# EAGLE schematic JKW_standalone (EAGLE 5.11)
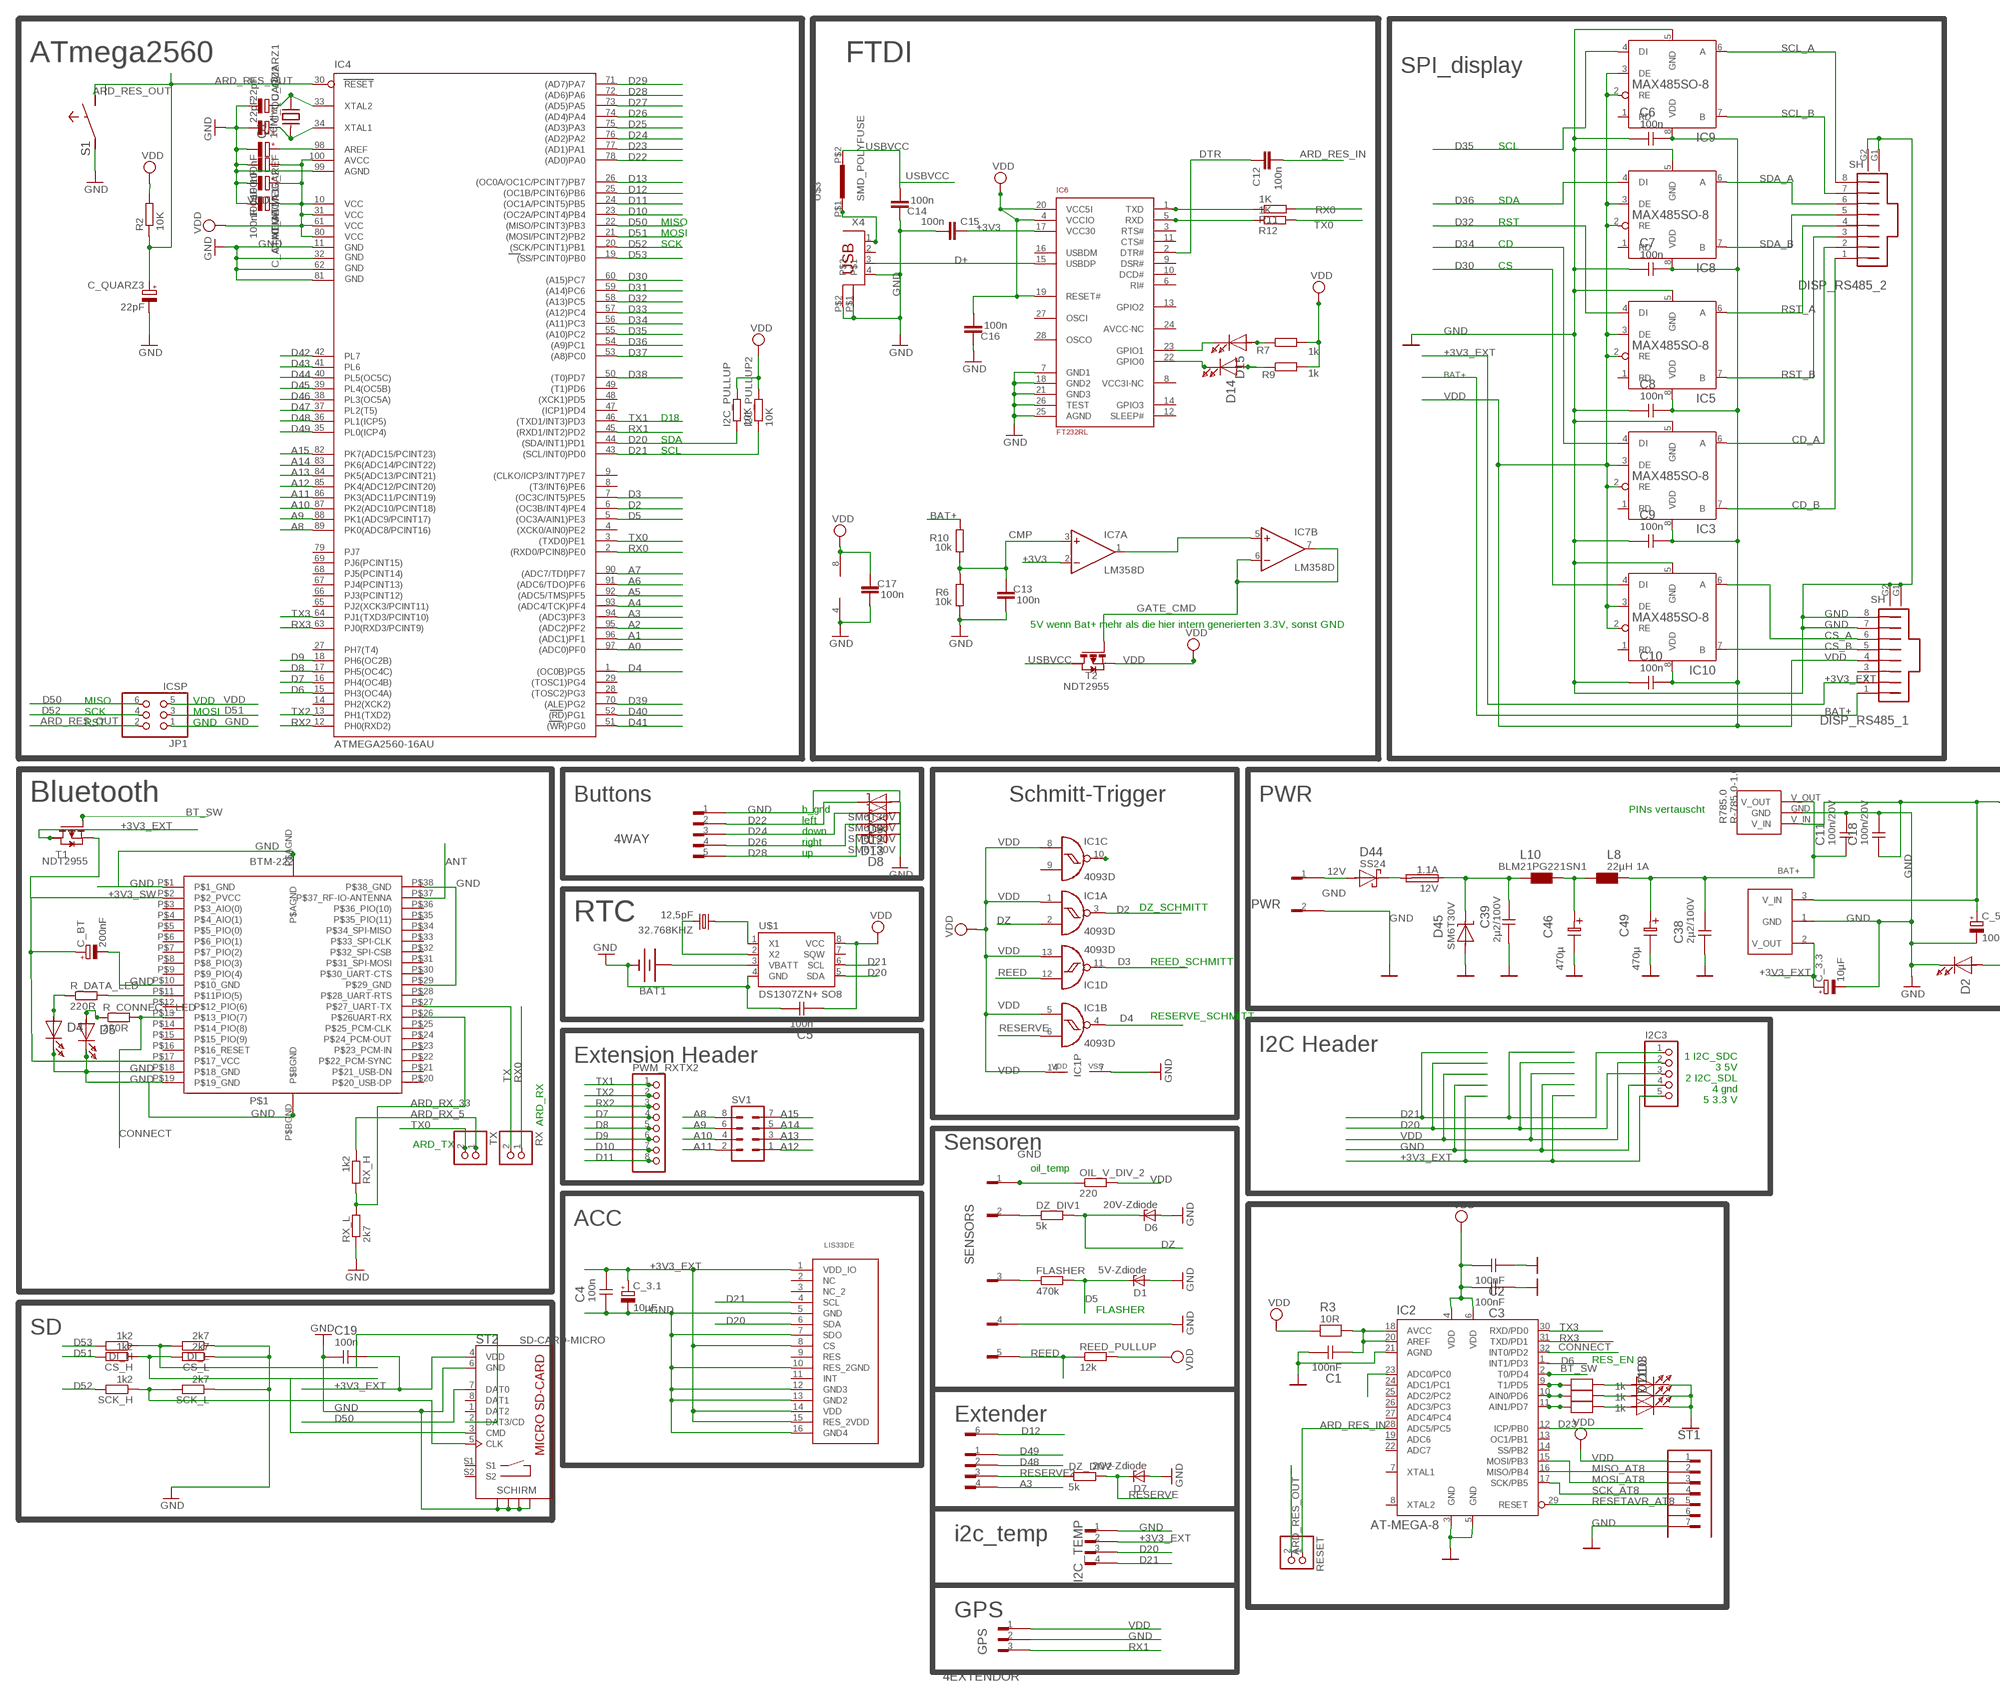
[diagram p0: schematic, sheet 1, part 1 of 2]
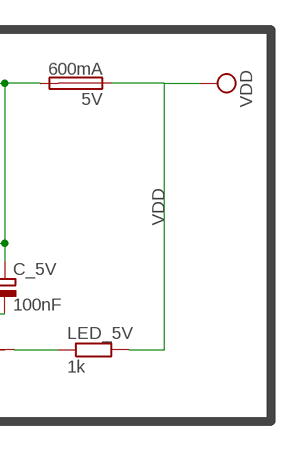
[diagram p1: schematic, sheet 1, part 2 of 2]

## Parts
4EXTENDOR  ST-04MCG35-04  [MCG35-04]
4WAY  ST-05MCG35-05  [MCG35-05]
5V  600mA  KOLJA_FUSE  [KOLJA_FUSE]
12V  1.1A  KOLJA_FUSE  [KOLJA_FUSE]
32.768KHZ  12,5pF  CRYSTALTC38H  [TC38H]
BAT1  BATTERY12PTH  [BATTCON_12MM_PTH]
C1  100nF  C0805  [0805]
C2  100nF  C0805  [0805]
C3  100nF  C0805  [0805]
C4  100n  C0805  [0805]
C5  100n  C0805  [0805]
C6  100n  C0805  [0805]
C7  100n  C0805  [0805]
C8  100n  C0805  [0805]
C9  100n  C0805  [0805]
C10  100n  C0805  [0805]
C11  100n/20V  C1210  [1210]
C12  100n  C-EUC0805  [C0805]
C13  100n  C-EUC0805  [C0805]
C14  100n  C-EUC0805  [C0805]
C15  100n  C-EUC0805  [C0805]
C16  100n  C-EUC0805  [C0805]
C17  100n  C-EUC0805  [C0805]
C18  100n/20V  C1210  [1210]
C19  100n  C0805  [0805]
C38  2µ2/100V  C1210  [1210]
C39  2µ2/100V  C1210  [1210]
C46  470µ  C-ELKO-5-8X13  [EL-5-8X13]
C49  470µ  C-ELKO-5-8X13  [EL-5-8X13]
C_3.1  10µF  CPOL-EUSMCP  [SMC_P]
C_3.3  10µF  CPOL-EUSMCP  [SMC_P]
C_5V  100nF  CPOL-EUSMCP  [SMC_P]
C_ATMEGA  100nF  CPOL-EUSMCP  [SMC_P]
C_ATMEGA1  100nF  CPOL-EUSMCP  [SMC_P]
C_ATMEGA2  100nF  CPOL-EUSMCP  [SMC_P]
C_BT  200nF  CPOL-EUSMCP  [SMC_P]
C_QUARZ1  22pF  CPOL-EUSMCP  [SMC_P]
C_QUARZ2  22pF  CPOL-EUSMCP  [SMC_P]
C_QUARZ3  22pF  CPOL-EUSMCP  [SMC_P]
C_REF  100nF  CPOL-EUSMCP  [SMC_P]
CS_H  1k2  R-EU_M0805  [M0805]
CS_L  2k7  R-EU_M0805  [M0805]
D1  5V-Zdiode  ZENER-DIODESOD80C  [SOD80C]
D2  LED0805  [LED-0805]
D3  LED0805  [LED-0805]
D4  LED0805  [LED-0805]
D5  LED0805  [LED-0805]
D6  20V-Zdiode  ZENER-DIODESOD80C  [SOD80C]
D7  20V-Zdiode  ZENER-DIODESOD80C  [SOD80C]
D8  SM6T30V  D-TD  [SMB]
D9  SM6T30V  D-TD  [SMB]
D10  LED0805  [LED-0805]
D11  LED0805  [LED-0805]
D12  SM6T30V  D-TD  [SMB]
D13  SM6T30V  D-TD  [SMB]
D14  LED0805  [LED-0805]
D15  LED0805  [LED-0805]
D44  SS24  D-SSMB-A+K  [SMB]
D45  SM6T30V  D-TD  [SMB]
DI_H  1k2  R-EU_M0805  [M0805]
DI_L  2k7  R-EU_M0805  [M0805]
DISP_RS485_1  RJ45-8_+2-SCHIRM_AMJ-188-0010100-CAT5  [RJ45_AMJ-188-0010100-CAT5]
DISP_RS485_2  RJ45-8_+2-SCHIRM_AMJ-188-0010100-CAT5  [RJ45_AMJ-188-0010100-CAT5]
DZ_DIV1  5k  R-EU_R0805W  [R0805W]
DZ_DIV2  5k  R-EU_R0805W  [R0805W]
FLASHER  470k  R-EU_R0805W  [R0805W]
GPS  ST-03MCG35-03  [MCG35-03]
I2C3  PINHD-1X5  [1X05]
I2C_PULLUP  10K  R-EU_M1206  [M1206]
I2C_PULLUP2  10K  R-EU_M1206  [M1206]
I2C_TEMP  ST-04MCG35-04  [MCG35-04]
IC1  4093D  [SO14]
IC2  AT-MEGA-8  [TQFP-32_7X7]
IC3  MAX485SO-8  [SO-8]
IC4  ATMEGA2560-16AU  [TQFP100]
IC5  MAX485SO-8  [SO-8]
IC6  FT232RL  [SSOP28]
IC7  LM358D  [SO08]
IC8  MAX485SO-8  [SO-8]
IC9  MAX485SO-8  [SO-8]
IC10  MAX485SO-8  [SO-8]
JP1  ICSP  PINHD-2X3  [2X03]
L8  22µH 1A  LPD54  [L-PD54]
L10  BLM21PG221SN1  L0808+0603  [0805+603]
LED_5V  1k  R-EU_R0805W  [R0805W]
LIS33DE  LIS33DE  [LGA16]
OIL_V_DIV_2  220  R-EU_R0805W  [R0805W]
P$1  BTM-222  [BTM-222]
PWM_RXTX2  PINHD-1X8  [1X08]
PWR  ST-02MCG35-02  [MCG35-02]
Q1  16Mhz  XT-HC49-SMD  [XT-HC49S-SMD]
R2  10K  R-EU_M1206  [M1206]
R3  10R  R0805  [0805]
R6  10k  R-EU_M0805  [M0805]
R7  1k  R-EU_M0805  [M0805]
R9  1k  R-EU_M0805  [M0805]
R10  10k  R-EU_M0805  [M0805]
R11  1K  R-EU_M0805  [M0805]
R12  1K  R-EU_M0805  [M0805]
R15  1k  R0805  [0805]
R16  1k  R0805  [0805]
R17  1k  R0805  [0805]
R785.0  R-785.0-1.0  R-785.0-0.5  [SIP-3]
R_CONNECT_LED  220R  R-EU_R0805W  [R0805W]
R_DATA_LED  220R  R-EU_R0805W  [R0805W]
REED_PULLUP  12k  R-EU_R0805W  [R0805W]
RESET  PINHD-1X2  [1X02]
RX  PINHD-1X2  [1X02]
RX_H  1k2  R-EU_M0805  [M0805]
RX_L  2k7  R-EU_M0805  [M0805]
S1  SW-TASTERECO-DIAGONAL  [SW-ECO]
SCK_H  1k2  R-EU_M0805  [M0805]
SCK_L  2k7  R-EU_M0805  [M0805]
SENSORS  ST-06MCG35-06  [MCG35-06]
ST1  ST-07PINHEAD  [1X07]
ST2  SD-CARD-MICRO  [SD-CARD-MICRO_PJS008-2100-0]
SV1  MA04-2  [MA04-2]
T1  NDT2955  PMOSSOT223  [SOT223]
T2  NDT2955  PMOSSOT223  [SOT223]
TX  PINHD-1X2  [1X02]
U$1  DS1307ZN+ SO8  DS1307SO8  [SO08]
U$2  AP1117E33G  [SOT223]
U$3  SMD_POLYFUSE  [SMD_POLYFUSE]
X4  PN61729  [PN61729]

## Nets
12V: D44.A PWR.1
+3V3 [power]: C15.2 IC6.17(VCC30) IC7.2(A:-IN)
+3V3_EXT: C4.2 C19.2 C_3.1.+ C_3.3.+ DISP_RS485_1.2 I2C3.5 I2C_TEMP.2 LIS33DE.1(VDD_IO) LIS33DE.8(CS) LIS33DE.14(VDD) LIS33DE.15(RES_2VDD) ST2.4(VDD) T1.2(D) U$2.2(V_OUT)
+3V3_SW: C_BT.+ P$1.P$2(P$2_PVCC) P$1.P$17(P$17_VCC) T1.3(S)
A0: IC4.97((ADC0)PF0)
A1: IC4.96((ADC1)PF1) OIL_V_DIV_2.1 SENSORS.1
A2: IC4.95((ADC2)PF2)
A3: 4EXTENDOR.4 IC4.94((ADC3)PF3)
A4: IC4.93((ADC4/TCK)PF4)
A5: IC4.92((ADC5/TMS)PF5)
A6: IC4.91((ADC6/TDO)PF6)
A7: IC4.90((ADC7/TDI)PF7)
A8: IC4.89(PK0(ADC8/PCINT16)) SV1.8
A9: IC4.88(PK1(ADC9/PCINT17)) SV1.6
A10: IC4.87(PK2(ADC10/PCINT18)) SV1.4
A11: IC4.86(PK3(ADC11/PCINT19)) SV1.2
A12: IC4.85(PK4(ADC12/PCINT20)) SV1.1
A13: IC4.84(PK5(ADC13/PCINT21)) SV1.3
A14: IC4.83(PK6(ADC14/PCINT22)) SV1.5
A15: IC4.82(PK7(ADC15/PCINT23)) SV1.7
ANT: P$1.P$37(P$37_RF-IO-ANTENNA)
ARD_RES_IN: C12.2 IC2.28(ADC5/PC5) RESET.1
ARD_RES_OUT: C_QUARZ3.+ IC4.30(RESET) JP1.2 R2.1 RESET.2 S1.4
ARD_RX_5: RX_H.1 TX.1
ARD_RX_33: P$1.P$26(P$26UART-RX) RX_H.2 RX_L.2
BAT+: C11.1 C38.2 C49.1 DISP_RS485_1.1 L8.2 R10.2 R785.0.V_OUT
BT_SW: IC2.2(T0/PD4) T1.1(G)
CD_A: DISP_RS485_2.2 IC3.6(A)
CD_B: DISP_RS485_2.1 IC3.7(B)
CMP: C13.2 IC7.3(A:+IN) R6.2 R10.1
CONNECT: IC2.32(INT0/PD2) P$1.P$13(P$13_PIO(7)) R_CONNECT_LED.2
CS_A: DISP_RS485_1.6 IC10.6(A)
CS_B: DISP_RS485_1.5 IC10.7(B)
D2: IC1.3(A:O) IC4.6((OC3B/INT4)PE4)
D3: IC1.11(D:O) IC4.7((OC3C/INT5)PE5)
D4: IC1.4(B:O) IC4.1((OC0B)PG5)
D5: D1.C FLASHER.2 IC4.5((OC3A/AIN1)PE3)
D6: IC2.1(INT1/PD3) IC4.15(PH3(OC4A))
D7: IC4.16(PH4(OC4B)) PWM_RXTX2.4
D8: IC4.17(PH5(OC4C)) PWM_RXTX2.5
D9: IC4.18(PH6(OC2B)) PWM_RXTX2.6
D10: IC4.23((OC2A/PCINT4)PB4) PWM_RXTX2.7
D11: IC4.24((OC1A/PCINT5)PB5) PWM_RXTX2.8
D12: IC4.25((OC1B/PCINT6)PB6) SENSORS.6
D13: IC4.26((OC0A/OC1C/PCINT7)PB7)
D20: I2C3.3 I2C_PULLUP.1 I2C_TEMP.3 IC4.44((SDA/INT1)PD1) LIS33DE.6(SDA) U$1.5(SDA)
D21: I2C3.1 I2C_PULLUP2.1 I2C_TEMP.4 IC4.43((SCL/INT0)PD0) LIS33DE.4(SCL) U$1.6(SCL)
D22: 4WAY.2 D9.K IC4.78((AD0)PA0)
D23: IC2.12(ICP/PB0) IC4.77((AD1)PA1)
D24: 4WAY.3 D12.K IC4.76((AD2)PA2)
D25: IC4.75((AD3)PA3)
D26: 4WAY.4 D13.K IC4.74((AD4)PA4)
D27: IC4.73((AD5)PA5)
D28: 4WAY.5 D8.K IC4.72((AD6)PA6)
D29: IC4.71((AD7)PA7)
D30: IC4.60((A15)PC7) IC10.4(DI)
D31: IC4.59((A14)PC6)
D32: IC4.58((A13)PC5) IC5.4(DI)
D33: IC4.57((A12)PC4)
D34: IC3.4(DI) IC4.56((A11)PC3)
D35: IC4.55((A10)PC2) IC9.4(DI)
D36: IC4.54((A9)PC1) IC8.4(DI)
D37: IC4.53((A8)PC0)
D38: IC4.50((T0)PD7)
D39: IC4.70((ALE)PG2)
D40: IC4.52((RD)PG1)
D41: IC4.51((WR)PG0)
D42: IC4.42(PL7)
D43: IC4.41(PL6)
D44: IC4.40(PL5(OC5C))
D45: IC4.39(PL4(OC5B))
D46: IC4.38(PL3(OC5A))
D47: IC4.37(PL2(T5))
D48: 4EXTENDOR.2 IC4.36(PL1(ICP5))
D49: 4EXTENDOR.1 IC4.35(PL0(ICP4))
D50: IC4.22((MISO/PCINT3)PB3) JP1.6 ST2.7(DAT0)
D51: CS_H.2 IC4.21((MOSI/PCINT2)PB2) JP1.3
D52: IC4.20((SCK/PCINT1)PB1) JP1.4 SCK_H.2
D53: DI_H.2 IC4.19((SS/PCINT0)PB0)
D+: IC6.15(USBDP) X4.3
DTR: C12.1 IC6.2(DTR#)
DZ: D6.C DZ_DIV1.2 IC1.2(A:I1)
GATE_CMD: IC7.6(B:-IN) IC7.7(B:OUT) T2.1(G)
GND: 4WAY.1 BAT1.GND(-) C1.2 C2.1 C3.1 C4.1 C5.2 C6.1 C7.1 C8.1 C9.1 C10.1 C11.2 C13.1 C14.2 C15.1 C16.2 C17.1 C18.2 C19.1 C38.1 C39.2 C46.2 C49.2 C_3.1.- C_3.3.- C_5V.- C_ATMEGA1.- C_ATMEGA2.- C_ATMEGA.- C_BT.- C_QUARZ1.- C_QUARZ2.- C_QUARZ3.- C_REF.- CS_L.1 D1.A D2.2(K) D3.2(K) D4.2(K) D5.2(K) D6.A D7.A D8.A D9.A D10.2(K) D11.2(K) D12.A D13.A D45.A DI_L.1 DISP_RS485_1.7 DISP_RS485_1.8 DISP_RS485_1.G1 DISP_RS485_1.G2 DISP_RS485_2.G1 DISP_RS485_2.G2 GPS.2 I2C3.4 I2C_TEMP.1 IC1.7(P:VSS) IC2.3(GND) IC2.5(GND) IC2.21(AGND) IC3.5(GND) IC4.11(GND) IC4.32(GND1) IC4.62(GND2) IC4.81(GND3) IC4.99(AGND) IC5.5(GND) IC6.7(GND1) IC6.18(GND2) IC6.21(GND3) IC6.25(AGND) IC6.26(TEST) IC7.4(P:V-) IC8.5(GND) IC9.5(GND) IC10.5(GND) JP1.1 LIS33DE.5(GND) LIS33DE.7(SDO) LIS33DE.10(RES_2GND) LIS33DE.12(GND3) LIS33DE.13(GND2) LIS33DE.16(GND4) P$1.P$1(P$1_GND) P$1.P$10(P$10_GND) P$1.P$18(P$18_GND) P$1.P$19(P$19_GND) P$1.P$29(P$29_GND) P$1.P$38(P$38_GND) P$1.P$AGND P$1.P$BGND PWR.2 R6.1 R785.0.GND RX_L.1 S1.1 SCK_L.1 SENSORS.4 ST1.7 ST2.6(GND) ST2.G1(SCHIRM) ST2.G2(SCHIRM1) ST2.G3(SCHIRM2) ST2.G4(SCHIRM3) U$1.4(GND) U$2.1(GND) X4.4 X4.P$1 X4.P$2 ; supply symbol labelled GND_SUPPLY
MISO_AT8: IC2.16(MISO/PB4) ST1.2
MOSI_AT8: IC2.15(MOSI/PB3) ST1.3
N$1: C46.1 L8.1 L10.2
N$2: D15.2(K) IC6.23(GPIO1)
N$3: C1.1 IC2.18(AVCC) IC2.20(AREF) R3.2
N$4: IC7.1(A:OUT) IC7.5(B:+IN)
N$5: D5.1(A) R_CONNECT_LED.1
N$6: 12V.IN C39.1 D45.K L10.1
N$7: IC6.1(TXD) R11.1
N$8: DZ_DIV1.1 SENSORS.2
N$9: D2.1(A) LED_5V.1
N$10: IC6.5(RXD) R12.1
N$12: D4.1(A) R_DATA_LED.1
N$13: CS_H.1 CS_L.2 ST2.3(CMD)
N$14: IC2.11(AIN1/PD7) R17.1
N$15: 32.768KHZ.2 U$1.2(X2)
N$16: 32.768KHZ.1 U$1.1(X1)
N$17: BAT1.VCC@1(+) U$1.3(VBATT)
N$18: IC2.10(AIN0/PD6) R16.1
N$19: 5V.OUT C18.1 C_5V.+ R785.0.V_IN U$2.3(V_IN)
N$20: IC2.9(T1/PD5) R15.1
N$21: FLASHER.1 SENSORS.3
N$22: IC1.10(C:O)
N$23: SCK_H.1 SCK_L.2 ST2.5(CLK)
N$24: 12V.OUT D44.K
N$26: DI_H.1 DI_L.2 ST2.2(DAT3/CD)
N$27: U$3.P$1 X4.1
N$35: C_QUARZ1.+ IC4.33(XTAL2) Q1.2
N$36: C_QUARZ2.+ IC4.34(XTAL1) Q1.1
N$37: C_REF.+ IC4.98(AREF)
N$53: D14.2(K) IC6.22(GPIO0)
N$54: D15.1(A) R7.1
N$55: D14.1(A) R9.1
P0: D3.1(A) R15.2
P1: D10.1(A) R16.2
P2: D11.1(A) R17.2
REED: IC1.12(D:I0) REED_PULLUP.1 SENSORS.5
RESERVE: D7.C DZ_DIV2.2 IC1.6(B:I1)
RESERVE2: 4EXTENDOR.3 DZ_DIV2.1
RESETAVR_AT8: IC2.29(RESET) ST1.5
RST_A: DISP_RS485_2.4 IC5.6(A)
RST_B: DISP_RS485_2.3 IC5.7(B)
RX0: IC4.2((RXD0/PCIN8)PE0) R11.2 RX.1
RX1: GPS.3 IC4.45((RXD1/INT2)PD2)
RX2: IC4.12(PH0(RXD2)) PWM_RXTX2.3
RX3: IC2.31(TXD/PD1) IC4.63(PJ0(RXD3/PCINT9))
SCK_AT8: IC2.17(SCK/PB5) ST1.4
SCL_A: DISP_RS485_2.8 IC9.6(A)
SCL_B: DISP_RS485_2.7 IC9.7(B)
SDA_A: DISP_RS485_2.6 IC8.6(A)
SDA_B: DISP_RS485_2.5 IC8.7(B)
TO_DATA_LED: P$1.P$11(P$11PIO(5)) R_DATA_LED.2
TX: P$1.P$27(P$27_UART-TX) RX.2
TX0: IC4.3((TXD0)PE1) R12.2 TX.2
TX1: IC4.46((TXD1/INT3)PD3) PWM_RXTX2.1
TX2: IC4.13(PH1(TXD2)) PWM_RXTX2.2
TX3: IC2.30(RXD/PD0) IC4.64(PJ1(TXD3/PCINT10))
USBVCC [usbvcc]: C14.1 T2.2(D) U$3.P$2
VDD: 5V.IN C2.2 C3.2 C5.1 C6.2 C7.2 C8.2 C9.2 C10.2 C16.1 C17.2 C_ATMEGA1.+ C_ATMEGA2.+ C_ATMEGA.+ DISP_RS485_1.4 GPS.1 I2C3.2 I2C_PULLUP2.2 I2C_PULLUP.2 IC1.1(A:I0) IC1.5(B:I0) IC1.8(C:I0) IC1.13(D:I1) IC1.14(P:VDD) IC2.4(VDD) IC2.6(VDD) IC3.2(RE) IC3.3(DE) IC3.8(VDD) IC4.10(VCC) IC4.31(VCC1) IC4.61(VCC2) IC4.80(VCC3) IC4.100(AVCC) IC5.2(RE) IC5.3(DE) IC5.8(VDD) IC6.4(VCCIO) IC6.19(RESET#) IC6.20(VCC5I) IC7.8(P:V+) IC8.2(RE) IC8.3(DE) IC8.8(VDD) IC9.2(RE) IC9.3(DE) IC9.8(VDD) IC10.2(RE) IC10.3(DE) IC10.8(VDD) JP1.5 LED_5V.2 OIL_V_DIV_2.2 R2.2 R3.1 R7.2 R9.2 REED_PULLUP.2 ST1.1 T2.3(S) U$1.8(VCC)
Unconnected: DISP_RS485_1.3 IC1.9(C:I1) IC2.7(XTAL1) IC2.8(XTAL2) IC2.13(OC1/PB1) IC2.14(SS/PB2) IC2.19(ADC6) IC2.22(ADC7) IC2.23(ADC0/PC0) IC2.24(ADC1/PC1) IC2.25(ADC2/PC2) IC2.26(ADC3/PC3) IC2.27(ADC4/PC4) IC3.1(RD) IC4.4((XCK0/AIN0)PE2) IC4.8((T3/INT6)PE6) IC4.9((CLKO/ICP3/INT7)PE7) IC4.14(PH2(XCK2)) IC4.27(PH7(T4)) IC4.28((TOSC2)PG3) IC4.29((TOSC1)PG4) IC4.47((ICP1)PD4) IC4.48((XCK1)PD5) IC4.49((T1)PD6) IC4.65(PJ2(XCK3/PCINT11)) IC4.66(PJ3(PCINT12)) IC4.67(PJ4(PCINT13)) IC4.68(PJ5(PCINT14)) IC4.69(PJ6(PCINT15)) IC4.79(PJ7) IC5.1(RD) IC6.3(RTS#) IC6.6(RI#) IC6.8(VCC3I-NC) IC6.9(DSR#) IC6.10(DCD#) IC6.11(CTS#) IC6.12(SLEEP#) IC6.13(GPIO2) IC6.14(GPIO3) IC6.16(USBDM) IC6.24(AVCC-NC) IC6.27(OSCI) IC6.28(OSCO) IC8.1(RD) IC9.1(RD) IC10.1(RD) LIS33DE.2(NC) LIS33DE.3(NC_2) LIS33DE.9(RES) LIS33DE.11(INT) P$1.P$3(P$3_AIO(0)) P$1.P$4(P$4_AIO(1)) P$1.P$5(P$5_PIO(0)) P$1.P$6(P$6_PIO(1)) P$1.P$7(P$7_PIO(2)) P$1.P$8(P$8_PIO(3)) P$1.P$9(P$9_PIO(4)) P$1.P$12(P$12_PIO(6)) P$1.P$14(P$14_PIO(8)) P$1.P$15(P$15_PIO(9)) P$1.P$16(P$16_RESET) P$1.P$20(P$20_USB-DP) P$1.P$21(P$21_USB-DN) P$1.P$22(P$22_PCM-SYNC) P$1.P$23(P$23_PCM-IN) P$1.P$24(P$24_PCM-OUT) P$1.P$25(P$25_PCM-CLK) P$1.P$28(P$28_UART-RTS) P$1.P$30(P$30_UART-CTS) P$1.P$31(P$31_SPI-MOSI) P$1.P$32(P$32_SPI-CSB) P$1.P$33(P$33_SPI-CLK) P$1.P$34(P$34_SPI-MISO) P$1.P$35(P$35_PIO(11)) P$1.P$36(P$36_PIO(10)) ST1.6 ST2.1(DAT2) ST2.8(DAT1) ST2.S1 ST2.S2 T1.4(D2) T2.4(D2) U$1.7(SQW) X4.2

## Notes on the sheet
- ATmega2560 | FTDI
- SPI_display
- SCL
- SDA
- MISO | RST
- MOSI
- SCK | CD
- CS
- D18
- SDA
- SCL
- 5V wenn Bat+ mehr als die hier intern generierten 3.3V, sonst GND
- MISO | VDD
- SCK | MOSI
- RST | GND
- Bluetooth | Buttons | Schmitt-Trigger | PWR
- b_gnd | PINs vertauscht
- left
- down
- right
- up
- DZ_SCHMITT
- RTC
- REED_SCHMITT
- RESERVE_SCHMITT
- I2C Header | 1 I2C_SDC
- Extension Header | 3 5V
- 2 I2C_SDL
- 4 gnd
- 5 3.3 V
- ARD_RX
- ARD_TX | Sensoren
- oil_temp
- ACC
- FLASHER
- SD
- RES_EN
- Extender
- i2c_temp
- GPS

## Library data of the parts
4EXTENDOR I2C_TEMP = CONNECT:ST-04
4WAY = CONNECT:ST-05: z.B.: NEXUS Serie 2127
5V 12V = kolja_fuse:KOLJA_FUSE
32.768KHZ = SparkFun:CRYSTAL: Crystals Various standard crystals. Proven footprints. Spark Fun Electronics SKU : COM-00534
BAT1 = SparkFun:BATTERY: Battery Holders Various common sizes : AA, AAA, 20mm coin cell and 12mm coin cell.
C1-C11 C18 C19 C38 C39 = RCLDT:C
C12-C17 = resistor:C-EU: CAPACITOR, European symbol
C46 C49 = RCLDT:C-ELKO
C_3.1 C_3.3 C_5V C_ATMEGA C_ATMEGA1 C_ATMEGA2 C_BT C_QUARZ1-C_QUARZ3 C_REF = resistor:CPOL-EU: POLARIZED CAPACITOR, European symbol
CS_H CS_L DI_H DI_L DZ_DIV1 DZ_DIV2 FLASHER I2C_PULLUP I2C_PULLUP2 LED_5V OIL_V_DIV_2 R2 R6 R7 R9-R12 R_CONNECT_LED R_DATA_LED REED_PULLUP RX_H RX_L SCK_H SCK_L = resistor:R-EU_: RESISTOR, European symbol
D1 D6 D7 = diode:ZENER-DIODE: Z-Diode
D2-D5 D10 D11 D14 D15 = OPTO:LED
D8 D9 D12 D13 D45 = RCLDT:D-TD
D44 = RCLDT:D-S
DISP_RS485_1 DISP_RS485_2 = CONNECT:RJ45-8_+2-SCHIRM
GPS = CONNECT:ST-03
I2C3 = pinhead:PINHD-1X5: PIN HEADER
IC1 = 40xx:4093: Quad 2-input NAND schmitt trigger
IC2 = µP´s+Pic´s:AT-MEGA-8
IC3 IC5 IC8-IC10 = linear:MAX485
IC4 = atmel-2005:ATMEGA*: MICROCONTROLLER 64/128/256 Kbytes FLASH 4 Kbytes EEPROM 8 Kbytes SRAM 86 General Purpose I/O pins 12-channels16-bit PWM 4 x Serial USARTs 16-channels 10-bit A/D
IC6 = SmartPrj:FT232RL
IC7 = linear:LM358: OP AMP also LM158; LM258; LM2904 Source: http://cache.national.com/ds/LM/LM158.pdf
JP1 = pinhead:PINHD-2X3: PIN HEADER
L8 L10 = RCLDT:L
LIS33DE = Kolja:LIS33DE: Hersteller: STMICROELECTRONICS Farnell Best.Nr.: 1838528 Herst.Bez.: LIS33DE
P$1 = btm-222:BTM-222: Rayson BTM-222 Bluetooth Modul all Pins
PWM_RXTX2 = pinhead:PINHD-1X8: PIN HEADER
PWR = CONNECT:ST-02
Q1 = XT:XT: Datenblatt von Citizen: http://www.citizencrystal.com/images/pdf/k-cm315.pdf
R3 R15-R17 = RCLDT:R
R785.0 = Kolja:R-785.0-0.5
RESET RX TX = pinhead:PINHD-1X2: PIN HEADER
S1 = SWITCH+RELAIS:SW-TASTER
SENSORS = CONNECT:ST-06
ST1 = CONNECT:ST-07
ST2 = CONNECT:SD-CARD-MICRO
SV1 = con-lstb:MA04-2: PIN HEADER
T1 T2 = zetex:PMOSSOT223: MOS FET; OC_FARNELL: unknown; OC_NEWARK: unknown
U$1 = SparkFun:DS1307
U$2 = Kolja:AP1117E33G
U$3 = Kolja:SMD_POLYFUSE
X4 = SmartPrj:PN61729: BERG USB connector

## Net classes
0 default: width 0.203 mm, drill 0.406 mm, clearance 0.203 mm
1 power: width 0.61 mm, drill 0.711 mm, clearance 0.203 mm
2 gnd: width 0.305 mm, drill 0.711 mm, clearance 0.203 mm
3 usbvcc: width 0.508 mm, drill 0.711 mm, clearance 0.203 mm